# EAGLE design MagnetChargerV2 (EAGLE 5.11)

## Sheet 1 of 2
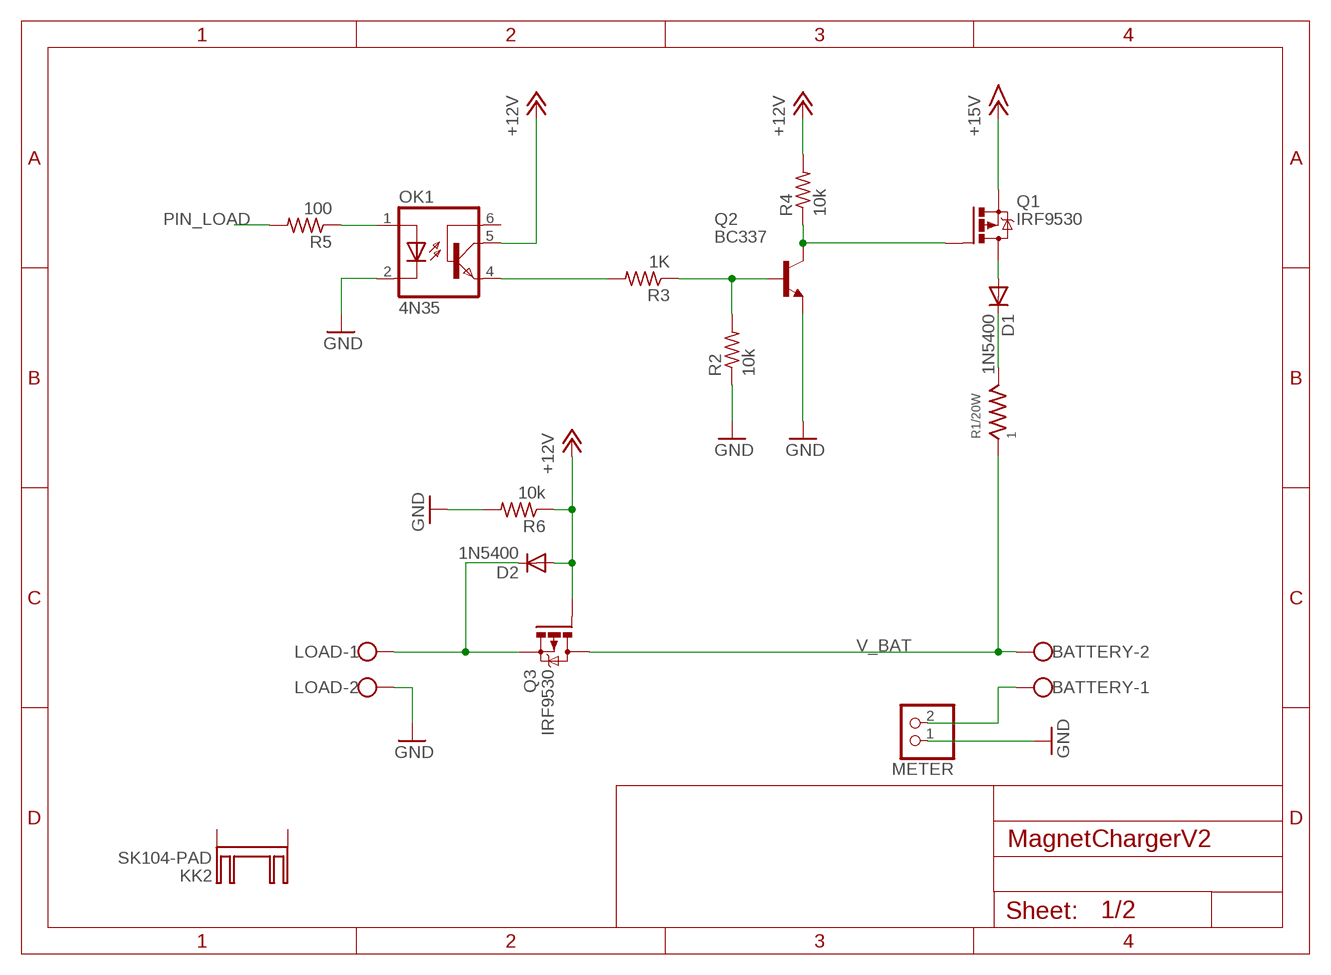
[diagram p0: schematic, sheet 1]

### Parts
BATTERY  W237-102  [W237-102]
D1  1N5400  [DO201-15]
D2  1N5400  [DO201-15]
KK2  SK104-PAD  [SK104-PAD]
LOAD  W237-102  [W237-102]
METER  PINHD-1X2  [1X02]
OK1  4N35  [DIL06]
Q1  IRF9530  [TO220BV]
Q2  BC337  [TO92]
Q3  IRF9530  [TO220BV]
R1/20W  1  R20W  [R20W]
R2  10k  R-US_R0603  [R0603]
R3  1K  R-US_R0603  [R0603]
R4  10k  R-US_R0603  [R0603]
R5  100  R-US_R0603  [R0603]
R6  10k  R-US_R0603  [R0603]

### Nets
+12V: D2.A OK1.5(COL) Q3.G R4.2 R6.1 ; also sheet 2
+15V: Q1.S ; also sheet 2
GND: LOAD.2 METER.1 OK1.2(C) Q2.1(E) R2.1 R6.2 ; also sheet 2
N$1: OK1.4(EMI) R3.2
N$2: Q2.2(B) R2.2 R3.1
N$3: Q1.G Q2.3(C) R4.1
N$4: D1.A Q1.D
N$5: D1.C R1/20W.2
N$7: OK1.1(A) R5.1
N$8: D2.C LOAD.1 Q3.S
N$17: BATTERY.1 METER.2
PIN_LOAD: R5.2 ; also sheet 2
V_BAT: BATTERY.2 Q3.D R1/20W.1 ; also sheet 2
Unconnected: KK2.K1(K) KK2.K2(K) OK1.6(BAS)

## Sheet 2 of 2
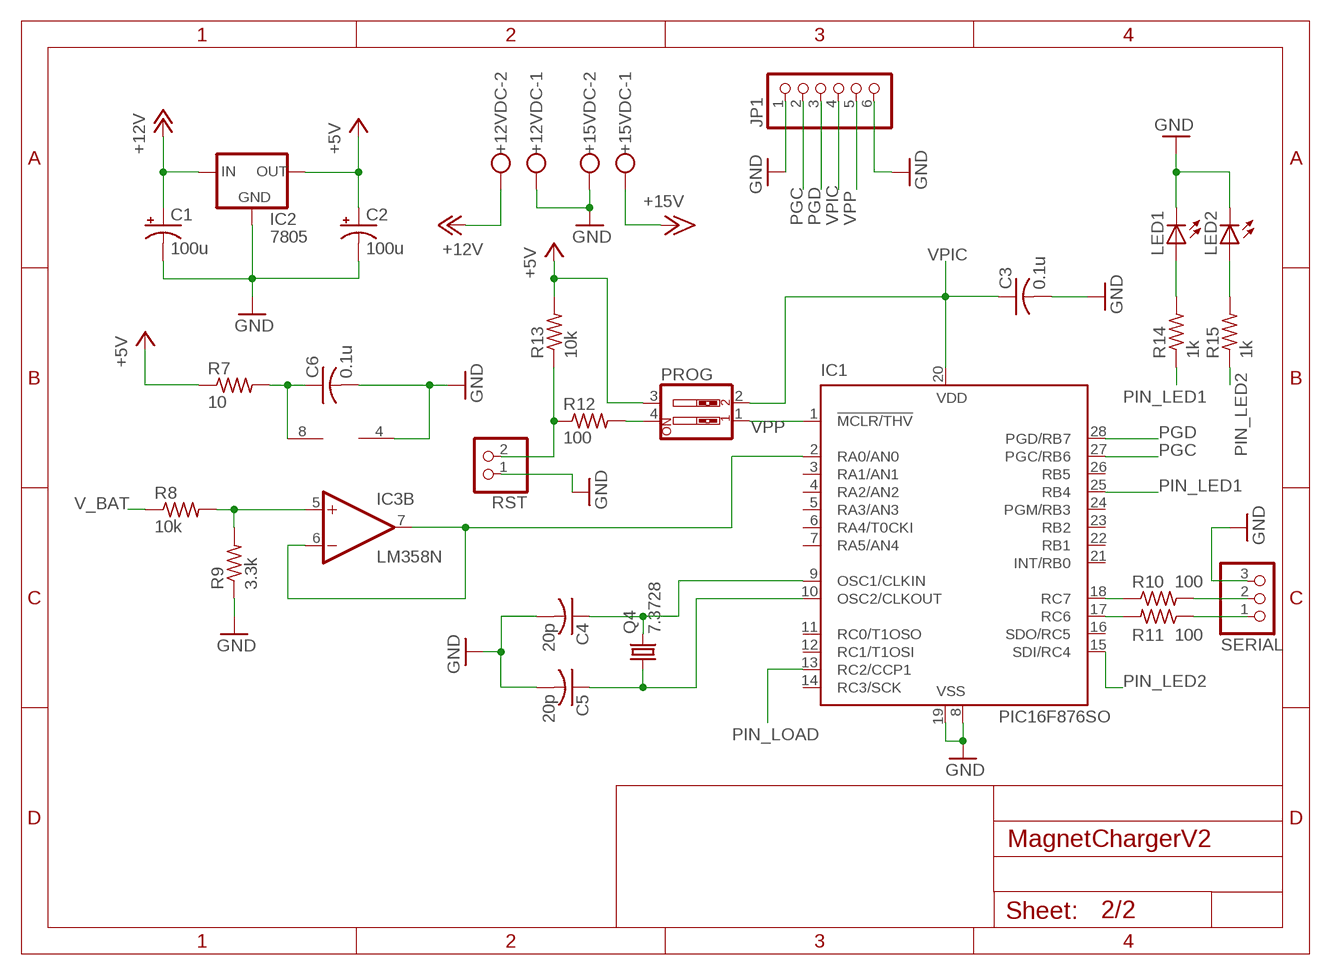
[diagram p1: schematic, sheet 2]

### Parts
+12VDC  W237-102  [W237-102]
+15VDC  W237-102  [W237-102]
C1  100u  CPOL-USE3.5-8  [E3,5-8]
C2  100u  CPOL-USE3.5-8  [E3,5-8]
C3  0.1u  C-USC0603  [C0603]
C4  20p  C-USC0603  [C0603]
C5  20p  C-USC0603  [C0603]
C6  0.1u  C-USC0603  [C0603]
IC1  PIC16F876SO  [SO28W]
IC2  7805  78XXS  [78XXS]
IC3  LM358N  [DIL08]
JP1  PINHD-1X6/90  [1X06/90]
LED1  LED3MM  [LED3MM]
LED2  LED3MM  [LED3MM]
PROG  SW_DIP-2  [EDG-02]
Q4  7.3728  CRYSTALSM49  [SM49]
R7  10  R-US_R0805  [R0805]
R8  10k  R-US_R0805  [R0805]
R9  3.3k  R-US_R0805  [R0805]
R10  100  R-US_R0603  [R0603]
R11  100  R-US_R0603  [R0603]
R12  100  R-US_R0603  [R0603]
R13  10k  R-US_R0603  [R0603]
R14  1k  R-US_R0603  [R0603]
R15  1k  R-US_R0603  [R0603]
RST  PINHD-1X2  [1X02]
SERIAL  PINHD-1X3/90  [1X03/90]

### Nets
+5V: C2.+ IC2.OUT PROG.3 R7.1 R13.2
+12V: +12VDC.2 C1.+ IC2.IN ; also sheet 1
+15V: +15VDC.1 ; also sheet 1
GND: +12VDC.1 +15VDC.2 C1.- C2.- C3.2 C4.2 C5.2 C6.2 IC1.8(VSS) IC1.19(VSS) IC2.GND IC3.4(P:V-) JP1.1 JP1.6 LED1.K(C) LED2.K(C) R9.1 RST.1 SERIAL.3 ; also sheet 1
N$6: C5.1 IC1.10(OSC2/CLKOUT) Q4.1
N$9: C4.1 IC1.9(OSC1/CLKIN) Q4.2
N$10: IC1.18(RC7) R10.1
N$11: C6.1 IC3.8(P:V+) R7.2
N$12: IC3.5(B:+IN) R8.2 R9.2
N$13: IC1.2(RA0/AN0) IC3.6(B:-IN) IC3.7(B:OUT)
N$14: IC1.17(RC6) R11.2
N$15: R11.1 SERIAL.1
N$19: R12.1 R13.1 RST.2
N$20: PROG.4 R12.2
N$26: R10.2 SERIAL.2
N$28: LED1.A R14.2
N$29: LED2.A R15.2
PGC: IC1.27(PGC/RB6) JP1.2
PGD: IC1.28(PGD/RB7) JP1.3
PIN_LED1: IC1.25(RB4) R14.1
PIN_LED2: IC1.15(SDI/RC4) R15.1
PIN_LOAD: IC1.13(RC2/CCP1) ; also sheet 1
V_BAT: R8.1 ; also sheet 1
VPIC: C3.1 IC1.20(VDD) JP1.4 PROG.2
VPP: IC1.1(!MCLR/THV) JP1.5 PROG.1
Unconnected: IC1.3(RA1/AN1) IC1.4(RA2/AN2) IC1.5(RA3/AN3) IC1.6(RA4/T0CKI) IC1.7(RA5/AN4) IC1.11(RC0/T1OSO) IC1.12(RC1/T1OSI) IC1.14(RC3/SCK) IC1.16(SDO/RC5) IC1.21(INT/RB0) IC1.22(RB1) IC1.23(RB2) IC1.24(PGM/RB3) IC1.26(RB5) IC3.1(A:OUT) IC3.2(A:-IN) IC3.3(A:+IN)

## Library data of the parts
+12VDC +15VDC BATTERY LOAD = con-wago-500:W237-102: WAGO SCREW CLAMP; MPN: 237-102; OC_FARNELL: unknown; OC_NEWARK: 70K9898
C1 C2 = rcl:CPOL-US: POLARIZED CAPACITOR, American symbol
C3-C6 = rcl:C-US: CAPACITOR, American symbol
D1 D2 = diode:1N5400: DIODE standard rectifier, 3 A, 50 V (Motorola)
IC1 = microchip:PIC16*876: MICROCONTROLLER flash type; MF: MICROCHIP; MPN: PIC16F876-20/SO; OC_FARNELL: 9761268; OC_NEWARK: 12C1950
IC2 = v-reg:78XXS: VOLTAGE REGULATOR
IC3 = linear:LM358: OP AMP also LM158; LM258; LM2904 Source: http://cache.national.com/ds/LM/LM158.pdf
JP1 = pinhead:PINHD-1X6: PIN HEADER
KK2 = heatsink:SK104-PAD: HEATSINK manufacturer Fischer/distributor Buerklin
LED1 LED2 = led:LED: LED OSRAM: - CHIPLED LG R971, LG N971, LY N971, LG Q971, LY Q971, LO R971, LY R971 LH N974, LH R974 LS Q976, LO Q976, LY Q976 LO Q996 - Hyper CHIPLED LW Q18S LB Q993, LB Q99A, LB R99A - SideLED LS A670, LO A670, LY A670, LG A670, LP A670 LB A673, LV A673, LT A673, LW A673 LH A674 LY A675 LS A676, LA A676, LO A676, LY A676, LW A676 LS A679, LY A679, LG A679 - Hyper Micro SIDELED® LS Y876, LA Y876, LO Y876, LY Y876 LT Y87S - SmartLED LW L88C, LW L88S LB L89C, LB L89S, LG L890 LS L89K, LO L89K, LY L89K LS L896, LA L896, LO L896, LY L896 - TOPLED LS T670, LO T670, LY T670, LG T670, LP T670 LSG T670, LSP T670, LSY T670, LOP T670, LYG T670 LG T671, LOG T671, LSG T671 LB T673, LV T673, LT T673, LW T673 LH T674 LS T676, LA T676, LO T676, LY T676, LB T676, LH T676, LSB T676, LW T676 LB T67C, LV T67C, LT T67C, LS T67K, LO T67K, LY T67K, LW E67C LS E67B, LA E67B, LO E67B, LY E67B, LB E67C, LV E67C, LT E67C LW T67C LS T679, LY T679, LG T679 LS T770, LO T770, LY T770, LG T770, LP T770 LB T773, LV T773, LT T773, LW T773 LH T774 LS E675, LA E675, LY E675, LS T675 LS T776, LA T776, LO T776, LY T776, LB T776 LHGB T686 LT T68C, LB T68C - Hyper Mini TOPLED® LB M676 - Mini TOPLED Santana® LG M470 LS M47K, LO M47K, LY M47K Source: http://www.osram.convergy.de LUXEON: - LUMILED® LXK2-PW12-R00, LXK2-PW12-S00, LXK2-PW14-U00, LXK2-PW14-V00 LXK2-PM12-R00, LXK2-PM12-S00, LXK2-PM14-U00 LXK2-PE12-Q00, LXK2-PE12-R00, LXK2-PE12-S00, LXK2-PE14-T00, LXK2-PE14-U00 LXK2-PB12-K00, LXK2-PB12-L00, LXK2-PB12-M00, LXK2-PB14-N00, LXK2-PB14-P00, LXK2-PB14-Q00 LXK2-PR12-L00, LXK2-PR12-M00, LXK2-PR14-Q00, LXK2-PR14-R00 LXK2-PD12-Q00, LXK2-PD12-R00, LXK2-PD12-S00 LXK2-PH12-R00, LXK2-PH12-S00 LXK2-PL12-P00, LXK2-PL12-Q00, LXK2-PL12-R00 Source: www.luxeon.com KINGBRIGHT: KA-3528ASYC Source: www.kingbright.com
METER RST = pinhead:PINHD-1X2: PIN HEADER
OK1 = optocoupler:4N35: MOTOROLA OPTO COUPLER; MF: FAIRCHILD SEMICONDUCTOR; MPN: 4N35; OC_FARNELL: 1328375; OC_NEWARK: 72K9946
PROG = special:SW_DIP-2: DIP SWITCH
Q1 Q3 = transistor-power:IRF9530: P-CHANNEL HEXFET POWER-MOS-FET Source: http://www.irf.com/product-info/datasheets/data/irf9530.pdf
Q2 = transistor-npn:BC337*: NPN Transistor
Q4 = crystal:CRYSTAL: CRYSTAL; OC_FARNELL: unknown; OC_NEWARK: unknown
R1/20W = LibraryMagnet:R20W
R2-R15 = rcl:R-US_: RESISTOR, American symbol
SERIAL = pinhead:PINHD-1X3: PIN HEADER

## Board
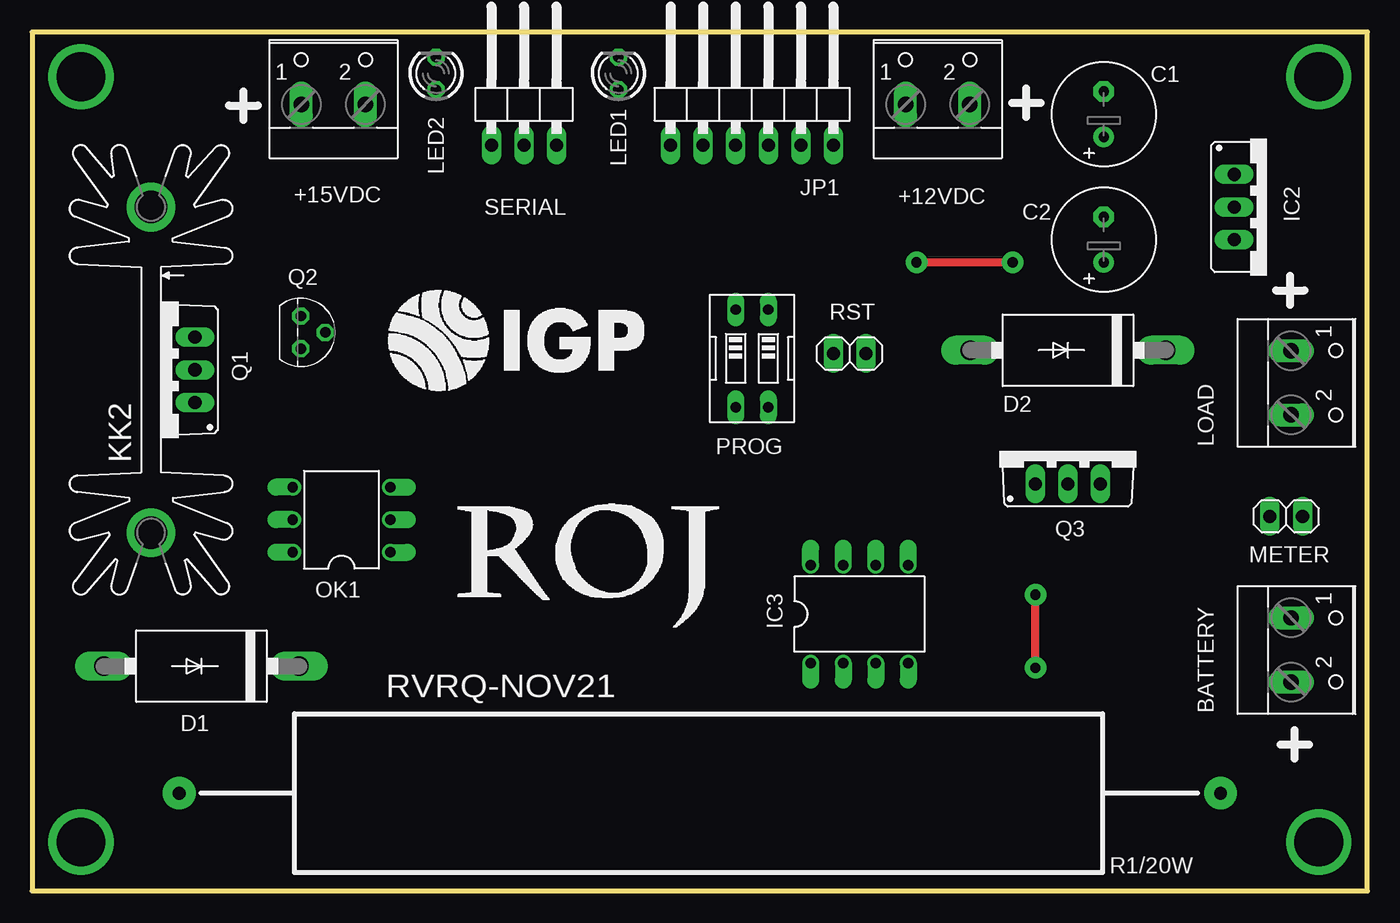
[diagram p2: board, top side]
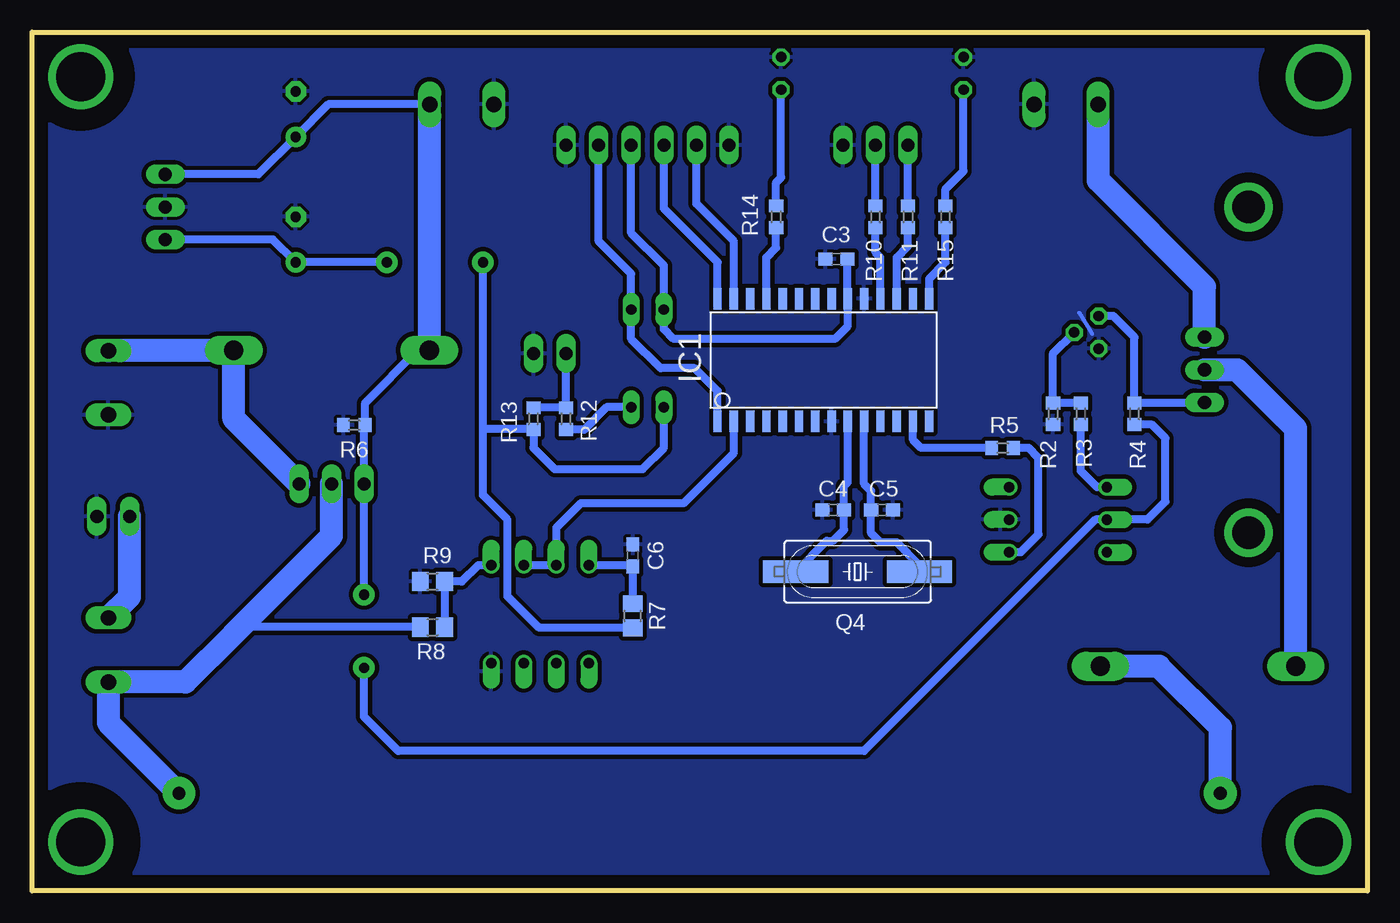
[diagram p3: board, bottom side, seen from below]

Size 104.12 x 66.98 mm. Coordinates in mm from the lower left corner, seen from the top.
Outline: 0,0 104.12,0 104.12,66.98 0,66.98 0,0
Copper layers (1*16): Top 0.035mm / dielectric 1.5mm / Bottom 0.035mm
Design rules "default": minimum track width 10mil, minimum drill 24mil, track to track 8mil, track to pad 8mil, pad to pad 8mil, via to via 8mil, smd to smd 8mil, copper to edge 40mil, drill to drill 8mil, minimum pad ring 10mil, minimum via ring 8mil, stop-mask expansion 4mil, vias tented up to drill 0mil, thermal gap 10mil
bRestrict: area -0.2,59.5 to 7.8,67.5; area 0,0 to 7.6,7.6; area 96.3,-0.2 to 104.3,7.8; area 96.7,59.9 to 103.9,67.1; area 7.2,25.9 to 11.3,30; area 7.2,51.3 to 11.3,55.4

### Footprints (pad centres in the part's own frame; a part is rotated, then mirrored left to right if it is on the bottom)
W237-102 = drill 1.194 long: 1 -2.5,-0.381; 2 2.5,-0.381
E3,5-8 = drill 0.813 pad 1.6 round: + -1.778,0 | drill 0.813 pad 1.6 octagon: - 1.778,0
C0603 = smd 1.1 x 1: 1 -0.85,0; 2 0.85,0
DO201-15 = drill 1.499 long: A 7.62,0; C -7.62,0
SO28W = smd 0.65 x 1.7: 1 -8.255,-4.78; 2 -6.985,-4.78; 3 -5.715,-4.78; 4 -4.445,-4.78; 5 -3.175,-4.78; 6 -1.905,-4.78; 7 -0.635,-4.78; 8 0.635,-4.78; 9 1.905,-4.78; 10 3.175,-4.78; 11 4.445,-4.78; 12 5.715,-4.78; 13 6.985,-4.78; 14 8.255,-4.78; 15 8.255,4.78; 16 6.985,4.78; 17 5.715,4.78; 18 4.445,4.78; 19 3.175,4.78; 20 1.905,4.78; 21 0.635,4.78; 22 -0.635,4.78; 23 -1.905,4.78; 24 -3.175,4.78; 25 -4.445,4.78; 26 -5.715,4.78; 27 -6.985,4.78; 28 -8.255,4.78
78XXS = drill 1.016 long: GND 0,-2.54; IN -2.54,-2.54; OUT 2.54,-2.54
DIL08 = drill 0.813 pad 1.27 offset: 1 -3.81,-3.81; 2 -1.27,-3.81; 3 1.27,-3.81; 4 3.81,-3.81; 5 3.81,3.81; 6 1.27,3.81; 7 -1.27,3.81; 8 -3.81,3.81
1X06/90 = drill 1.016 long: 1 -6.35,-3.81; 2 -3.81,-3.81; 3 -1.27,-3.81; 4 1.27,-3.81; 5 3.81,-3.81; 6 6.35,-3.81
SK104-PAD = drill 2.54 pad 3.81 round: K1 -12.7,-0.762; K2 12.7,-0.762
LED3MM = drill 0.813 octagon: A -1.27,0; K 1.27,0
1X02 = drill 1.016 long: 1 -1.27,0; 2 1.27,0
DIL06 = drill 0.813 offset: 1 -2.54,-3.81; 2 0,-3.81; 3 2.54,-3.81; 4 2.54,3.81; 5 0,3.81; 6 -2.54,3.81
EDG-02 = drill 0.813 long: 1 -1.27,-3.81; 2 1.27,-3.81; 3 1.27,3.81; 4 -1.27,3.81
TO220BV = drill 1.016 long: D 0,-2.54; G -2.54,-2.54; S 2.54,-2.54
TO92 = drill 0.813 octagon: 1 1.27,0; 2 0,1.905; 3 -1.27,0
SM49 = smd 5.08 x 1.778: 1 -4.826,0; 2 4.826,0
R20W = drill 1 pad 2.54 round: 1 -40.6,0; 2 40.6,0
R0603 = smd 1 x 1.1: 1 -0.85,0; 2 0.85,0
R0805 = smd 1.3 x 1.5: 1 -0.95,0; 2 0.95,0
1X03/90 = drill 1.016 long: 1 -2.54,-3.81; 2 0,-3.81; 3 2.54,-3.81

### Placement (x,y rotation side)
+12VDC  70.61,61.72 0 top
+15VDC  23.5,61.72 0 top
BATTERY  98.55,18.8 270 top
C1  83.57,60.58 90 top
C2  83.57,50.8 90 top
C3  41.4,49.28 180 bottom
C4  41.66,29.72 180 bottom
C5  37.85,29.72 0 bottom
C6  57.28,26.16 90 bottom
D1  13.21,17.53 180 top
D2  80.77,42.16 180 top
IC1  42.42,41.4 0 bottom
IC2  96.27,53.34 270 top
IC3  64.52,21.59 0 top
JP1  56.13,61.98 0 top
KK2  10.03,40.64 270 top
LED1  45.72,63.75 90 top
LED2  31.5,63.75 90 top
LOAD  98.55,39.62 270 top
METER  97.79,29.21 180 top
OK1  24.13,28.96 90 top
PROG  56.13,41.53 180 top
Q1  10.16,40.64 90 top
Q2  20.95,43.56 270 top
Q3  80.77,34.29 0 top
Q4  39.75,24.89 180 bottom
R1/20W  52.07,7.62 180 top
R2  24.51,37.21 90 bottom
R3  22.35,37.21 270 bottom
R4  18.16,37.21 270 bottom
R5  28.45,34.54 180 bottom
R6  78.99,36.32 180 bottom
R7  57.28,21.46 90 bottom
R8  72.9,20.57 0 bottom
R9  72.9,24.13 0 bottom
R10  38.35,52.58 90 bottom
R11  35.81,52.58 270 bottom
R12  62.48,36.83 270 bottom
R13  65.02,36.83 270 bottom
R14  46.1,52.58 90 bottom
R15  32.89,52.58 90 bottom
RST  63.75,41.91 180 top
SERIAL  38.35,61.98 0 top

### Tracks (layer width: path | path; a pad name or v marks a point on that pad's centre or on a via)
+5V  (via drill 0.8 pad 1.68)
  Top 0.61: v68.96,49.02 v76.45,49.02
  Bottom 0.61: PROG.3 54.86,34.54 56.52,32.89 63.37,32.89 65.02,34.54 R13.2 65.11,36.07 68.96,36.07 | IC2.OUT 85.34,50.8 C2.+ v76.45,49.02 | 68.96,36.07 68.96,30.86 67.06,28.96 67.06,22.99 64.58,20.51 R7.1 | 68.96,36.07 v68.96,49.02
+12V  (via drill 0.8 pad 1.68)
  Top 0.61: v78.23,17.4 v78.23,23.11
  Bottom 0.61: R4.2 16.8,36.36 15.75,35.31 15.75,30.35 17.14,28.96 OK1.5 21.21,28.96 39.24,10.92 75.56,10.92 78.23,13.59 v78.23,17.4 | C1.+ 83.31,59.05 | C1.+ 86.49,55.88 IC2.IN | D2.A 74.04,42.16 78.14,38.06 R6.1 78.23,36.23 Q3.G v78.23,23.11 | +12VDC.2 81.03,61.34 C1.+
  Bottom 1.016: D2.A 73.11,42.2
  Bottom 1.778: 73.11,42.2 +12VDC.2
+15V
  Bottom 1.778: Q1.S 12.7,47.12 21,55.41 +15VDC.1
GND
  Bottom 0.305: 21.46,43.43 22.48,45.09
  pour Bottom (isolate 0.33): -0.76,68.2 106.68,68.2 106.68,-2.54 -0.76,-2.54
N$1
  Bottom 0.61: OK1.4 21.08,31.5 22.35,32.77 R3.2
N$2
  Bottom 0.61: Q2.2 24.51,41.91 R2.2 R3.1
N$3
  Bottom 0.61: Q1.G 12.74,38.06 R4.1 18.16,43.18 19.81,44.83 Q2.3
N$4
  Bottom 1.778: Q1.D 10.16,40.64 5.59,36.07 D1.A
N$5
  Bottom 1.778: D1.C 16.26,17.53 11.47,12.74 R1/20W.2
N$6
  Bottom 0.61: IC1.10 39.24,31.75 38.7,31.2 C5.1 38.7,27.9 37.97,27.18 36.7,27.18 34.92,25.4 Q4.1
N$7
  Bottom 0.61: R5.1 26.42,34.54 25.65,33.78 25.65,27.81 27.05,26.42 OK1.1
N$8
  Bottom 1.016: D2.C 88.43,42.12
  Bottom 1.778: Q3.S 88.39,36.83 D2.C | 88.43,42.12 LOAD.1
N$9
  Bottom 0.61: IC1.9 40.51,31.88 40.81,31.58 C4.1 40.81,28.16 41.66,27.3 42.16,27.3 Q4.2
N$10
  Bottom 0.61: IC1.18 37.97,49.4 38.35,49.78 R10.1
N$11
  Bottom 0.61: IC3.8 57.37,25.4 C6.1 R7.2
N$12
  Bottom 0.61: R8.2 R9.2 70.61,24.13 69.34,25.4 IC3.5
N$13
  Bottom 0.61: IC3.6 IC3.7 63.25,28.32 61.34,30.23 53.34,30.23 49.4,34.16 IC1.2
N$14
  Bottom 0.61: IC1.17 36.7,49.4 35.81,50.29 R11.2
N$15
  Bottom 0.61: R11.1 SERIAL.1
N$17
  Bottom 1.778: BATTERY.1 96.52,22.95 METER.2
N$18  (via drill 3.81 pad 5.08)
  other vias: 3.81,3.81
N$19
  Bottom 0.61: RST.2 R12.1 R13.1
N$20
  Bottom 0.61: PROG.4 59.31,37.72 61.05,35.98 R12.2
N$23  (via drill 3.81 pad 5.08)
  other vias: 100.33,3.81
N$24  (via drill 3.81 pad 5.08)
  other vias: 100.33,63.5
N$25  (via drill 3.81 pad 5.08)
  other vias: 3.81,63.5
N$26
  Bottom 0.61: R10.2 SERIAL.2
N$28
  Bottom 0.61: R14.2 46.1,55.24 45.72,55.63 LED1.A
N$29
  Bottom 0.61: R15.2 32.89,54.74 31.5,56.13 LED2.A
PGC
  Bottom 0.61: IC1.27 49.4,50.67 52.32,53.59 JP1.2
PGD
  Bottom 0.61: IC1.28 50.67,49.02 54.86,53.21 JP1.3
PIN_LED1
  Bottom 0.61: IC1.25 46.86,49.4 46.1,50.16 R14.1
PIN_LED2
  Bottom 0.61: IC1.15 34.16,47.75 32.89,49.02 R15.1
PIN_LOAD
  Bottom 0.61: R5.2 34.8,34.54 35.43,35.18 IC1.13
V_BAT
  Bottom 0.61: R8.1 87.88,20.57 88.46,20
  Bottom 1.778: R1/20W.1 98.17,13.12 BATTERY.2 92.16,16.3 88.46,20 80.77,27.69 Q3.D
VPIC
  Bottom 0.61: C3.1 40.55,46.22 IC1.20 40.51,44.07 41.53,43.05 54.1,43.05 54.86,43.81 PROG.2 54.86,48.77 57.4,51.31 JP1.4
VPP
  Bottom 0.61: IC1.1 50.67,38.99 52.45,40.77 55.12,40.77 57.4,43.05 PROG.1 57.4,48.13 59.94,50.67 JP1.5

### Text on the board
tPlace: RVRQ-NOV21